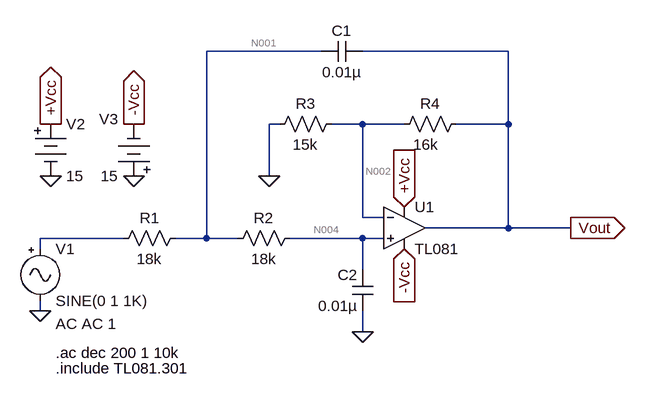
[diagram p0: schematic 2nd order Chebyshev filter.asc]
2nd order Chebyshev filter.asc, the LTspice schematic file:
Version 4
SHEET 1 880 680
WIRE 368 -128 192 -128
WIRE 656 -128 432 -128
WIRE 304 -16 288 -16
WIRE 432 -16 384 -16
WIRE 496 -16 432 -16
WIRE 656 -16 656 -128
WIRE 656 -16 576 -16
WIRE 288 64 288 -16
WIRE 432 128 432 -16
WIRE 464 128 432 128
WIRE 656 144 656 -16
WIRE 656 144 528 144
WIRE 752 144 656 144
WIRE 64 160 -64 160
WIRE 192 160 192 -128
WIRE 192 160 144 160
WIRE 240 160 192 160
WIRE 432 160 320 160
WIRE 464 160 432 160
WIRE -64 176 -64 160
WIRE 432 208 432 160
WIRE -64 272 -64 256
WIRE 432 304 432 272
FLAG 432 304 0
FLAG 288 64 0
FLAG 752 144 Vout
IOPIN 752 144 Out
FLAG -64 272 0
FLAG -48 64 0
FLAG 80 64 0
FLAG -48 -16 +Vcc
IOPIN -48 -16 Out
FLAG 80 -16 -Vcc
IOPIN 80 -16 Out
FLAG 496 112 +Vcc
IOPIN 496 112 In
FLAG 496 176 -Vcc
IOPIN 496 176 In
SYMBOL res 160 144 R90
WINDOW 0 0 56 VBottom 2
WINDOW 3 32 56 VTop 2
SYMATTR InstName R1
SYMATTR Value 18k
SYMBOL res 336 144 R90
WINDOW 0 0 56 VBottom 2
WINDOW 3 32 56 VTop 2
SYMATTR InstName R2
SYMATTR Value 18k
SYMBOL res 400 -32 R90
WINDOW 0 0 56 VBottom 2
WINDOW 3 32 56 VTop 2
SYMATTR InstName R3
SYMATTR Value 15k
SYMBOL res 592 -32 R90
WINDOW 0 0 56 VBottom 2
WINDOW 3 32 63 VTop 2
SYMATTR InstName R4
SYMATTR Value 16k
SYMBOL cap 432 -144 R90
WINDOW 0 0 32 VBottom 2
WINDOW 3 32 32 VTop 2
SYMATTR InstName C1
SYMATTR Value 0.01µ
SYMBOL cap 448 272 R180
WINDOW 0 24 56 Left 2
WINDOW 3 24 8 Left 2
SYMATTR InstName C2
SYMATTR Value 0.01µ
SYMBOL Misc\\signal -64 160 R0
WINDOW 123 24 132 Left 2
WINDOW 39 0 0 Left 0
SYMATTR Value2 AC AC 1
SYMATTR InstName V1
SYMBOL Misc\\battery -48 -32 R0
WINDOW 123 0 0 Left 0
WINDOW 39 0 0 Left 0
SYMATTR InstName V2
SYMATTR Value 15
SYMBOL Misc\\battery 80 80 R180
WINDOW 0 24 104 Left 2
WINDOW 3 24 16 Left 2
WINDOW 123 0 0 Left 0
WINDOW 39 0 0 Left 0
SYMATTR InstName V3
SYMATTR Value 15
SYMBOL OpAmps\\opamp2 496 80 R0
SYMATTR InstName U1
SYMATTR Value TL081
TEXT -40 336 Left 2 !.ac dec 200 1 10k
TEXT -40 360 Left 2 !.include TL081.301

The netlist it stands for:
* 2nd order Chebyshev filter.asc
R1 N001 N003 18k
R2 N004 N001 18k
R3 N002 0 15k
R4 Vout N002 16k
C1 Vout N001 0.01µ
C2 0 N004 0.01µ
V1 N003 0 SINE(0 1 1K) AC AC 1
V2 +Vcc 0 15
V3 0 -Vcc 15
XU1 N004 N002 +Vcc -Vcc Vout TL081  ; pins In+ In- V+ V- OUT
.ac dec 200 1 10k
.include TL081.301
.backanno
.end

* Results of the author's LTspice run, read from the files saved beside the schematic
* Operating Point, zero values left out:
*   V(n001) = -811 nV
*   V(n004) = -1.622 µV
*   V(n002) = 9.349 µV
*   V(vout) = 20.04 µV
*   V(+vcc) = 15 V
*   V(-vcc) = -15 V
*   I(R1) = -45.05 pA
*   I(R2) = -45.05 pA
*   I(R3) = 623.2 pA
*   I(R4) = 668.3 pA
*   I(V1) = -45.05 pA
*   I(V2) = -14.19 mA
*   I(V3) = -14.19 mA
*   Ix(u1:1) = 45.05 pA
*   Ix(u1:2) = 45.05 pA
*   Ix(u1:3) = 14.19 mA
*   Ix(u1:4) = -14.19 mA
*   Ix(u1:5) = -668.3 pA
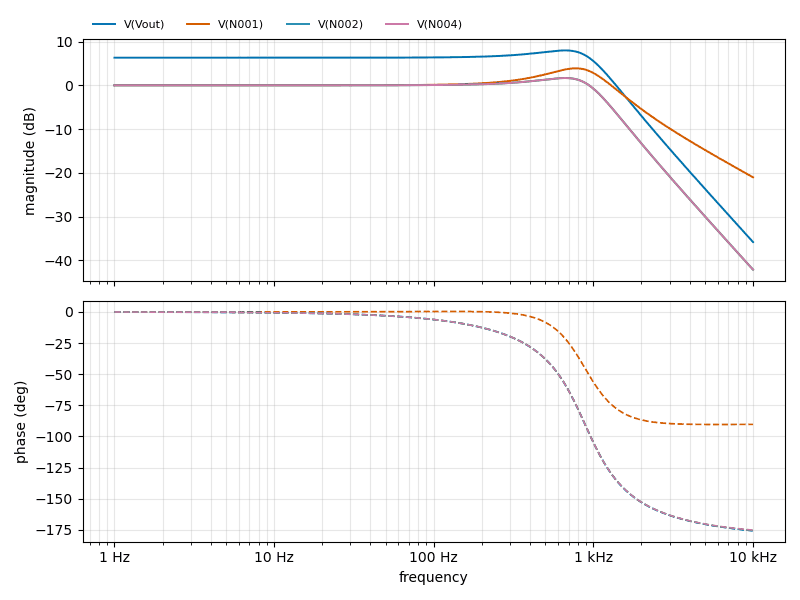
[diagram p1: AC Analysis of 2nd order Chebyshev filter.asc, plotted from the saved traces]
* AC Analysis, 1 run:
*   V(Vout): 6.31 dB at 1 Hz, -35.81 dB at 10 kHz, peak 7.97 dB at 660.7 Hz, 3 dB below the peak at 1.042 kHz
*   V(N001): 0.00 dB at 1 Hz, -21.01 dB at 10 kHz, peak 3.89 dB at 776.2 Hz, 3 dB below the peak at 277.9 Hz and 1.201 kHz
*   V(N002): -0.00 dB at 1 Hz, -42.11 dB at 10 kHz, peak 1.67 dB at 660.7 Hz, 3 dB below the peak at 1.042 kHz
*   V(N004): 0.00 dB at 1 Hz, -42.11 dB at 10 kHz, peak 1.67 dB at 660.7 Hz, 3 dB below the peak at 1.042 kHz